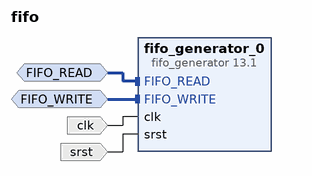
[diagram p0: block diagram of the top level]
# Vivado block design fifo, xc7z020clg484-1, Vivado 2017.2
create_bd_design fifo

create_bd_intf_port -mode Slave -vlnv xilinx.com:interface:fifo_read_rtl:1.0 FIFO_READ
create_bd_intf_port -mode Slave -vlnv xilinx.com:interface:fifo_write_rtl:1.0 FIFO_WRITE
create_bd_port -dir I -type clk clk
create_bd_port -dir I srst

create_bd_cell -type ip -vlnv xilinx.com:ip:fifo_generator:13.1 fifo_generator_0
set_property -dict {CONFIG.Performance_Options First_Word_Fall_Through} [get_bd_cells fifo_generator_0]

# ---- connections ----

connect_bd_intf_net [get_bd_intf_ports FIFO_READ] [get_bd_intf_pins fifo_generator_0/FIFO_READ]
connect_bd_intf_net [get_bd_intf_ports FIFO_WRITE] [get_bd_intf_pins fifo_generator_0/FIFO_WRITE]
connect_bd_net [get_bd_ports clk] [get_bd_pins fifo_generator_0/clk]
connect_bd_net [get_bd_ports srst] [get_bd_pins fifo_generator_0/srst]

validate_bd_design
save_bd_design
